# Altium schematic sheet Top.SchDoc
size A
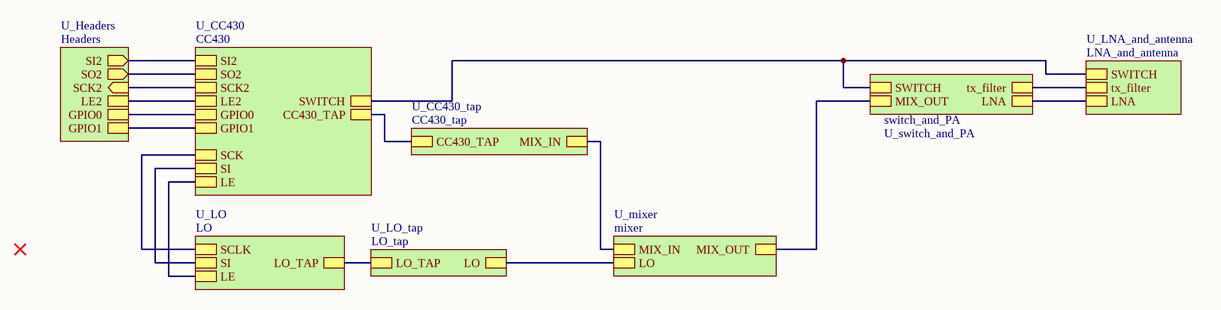
[diagram p0: Top.SchDoc]

## Sub-sheets
U_CC430 = CC430: CC430_TAP, SI, SCK, LE, SWITCH, SI2, SCK2, LE2, GPIO0, GPIO1, SO2
U_CC430_tap = CC430_tap: CC430_TAP, MIX_IN
U_Headers = Headers: SCK2 (in), SI2 (out), GPIO0, GPIO1, LE2, SO2 (out)
U_LNA_and_antenna = LNA_and_antenna: LNA, tx_filter, SWITCH
U_LO = LO: LO_TAP, SCLK, SI, LE
U_LO_tap = LO_tap: LO_TAP, LO
U_mixer = mixer: MIX_IN, MIX_OUT, LO
U_switch_and_PA = switch_and_PA: MIX_OUT, SWITCH, LNA, tx_filter

## Nets
(unnamed): sheet U_LNA_and_antenna/LNA, sheet U_switch_and_PA/LNA
(unnamed): sheet U_LNA_and_antenna/tx_filter, sheet U_switch_and_PA/tx_filter
(unnamed): sheet U_LNA_and_antenna/SWITCH, sheet U_switch_and_PA/SWITCH, sheet U_CC430/SWITCH
(unnamed): sheet U_switch_and_PA/MIX_OUT, sheet U_mixer/MIX_OUT
(unnamed): sheet U_Headers/SCK2, sheet U_CC430/SCK2
(unnamed): sheet U_Headers/SI2, sheet U_CC430/SI2
(unnamed): sheet U_Headers/GPIO0, sheet U_CC430/GPIO0
(unnamed): sheet U_Headers/GPIO1, sheet U_CC430/GPIO1
(unnamed): sheet U_Headers/LE2, sheet U_CC430/LE2
(unnamed): sheet U_Headers/SO2, sheet U_CC430/SO2
(unnamed): sheet U_CC430_tap/CC430_TAP, sheet U_CC430/CC430_TAP
(unnamed): sheet U_CC430_tap/MIX_IN, sheet U_mixer/MIX_IN
(unnamed): sheet U_LO_tap/LO_TAP, sheet U_LO/LO_TAP
(unnamed): sheet U_LO_tap/LO, sheet U_mixer/LO
(unnamed): sheet U_CC430/SI, sheet U_LO/SI
(unnamed): sheet U_CC430/SCK, sheet U_LO/SCLK
(unnamed): sheet U_CC430/LE, sheet U_LO/LE